# Altium schematic sheet Sheet_4.schdoc
size 232 x 101 mm
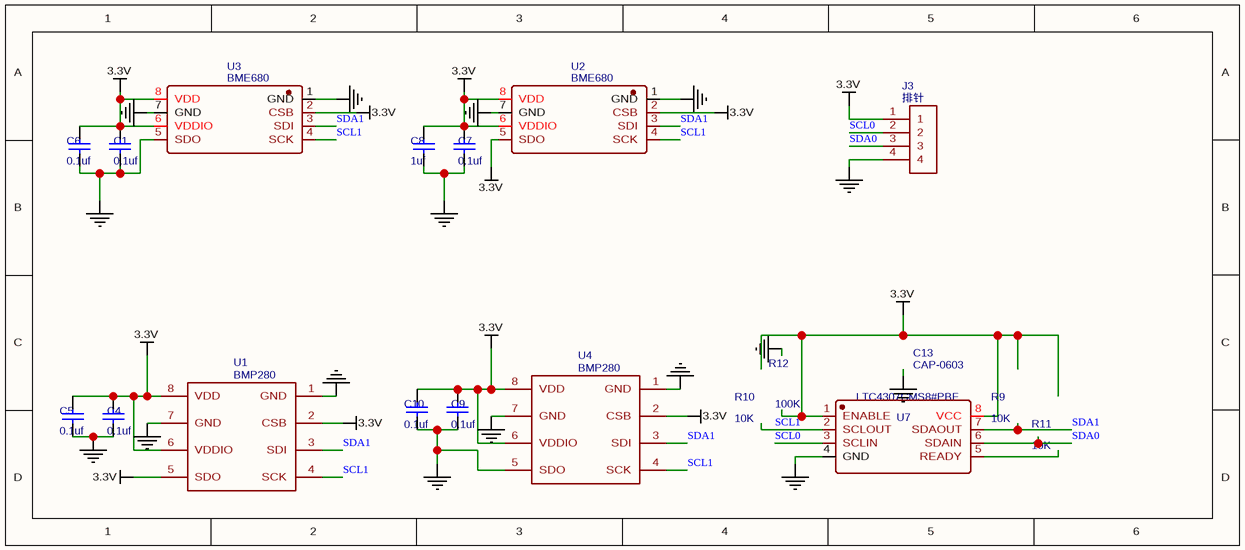
[diagram p0: Sheet_4.schdoc]

## Parts
C1  0.1uf  [N0603]
C4  0.1uf  [N0603]
C5  0.1uf  [N0603]
C6  0.1uf  [N0603]
C7  0.1uf  [N0603]
C8  1uf  [N0603]
C9  0.1uf  [N0603]
C10  0.1uf  [N0603]
C13  CAP-0603  [0603]
J3  排针  [PIN_4*2.54]
R9  10K  [0603]
R10  10K  [0603]
R11  10K  [0603]
R12  100K  [0603]
U1  BMP280  [LGA-8]
U2  BME680  [LGA-8-3X3MM]
U3  BME680  [LGA-8-3X3MM]
U4  BMP280  [LGA-8]
U7  LTC4307CMS8#PBF  [MSOP-8]

## Nets
3.3V: C1.1 C4.1 C5.1 C6.1 C7.1 C8.1 C9.1 C10.1 J3.1 U1.2(CSB) U1.5(SDO) U1.6(VDDIO) U1.8(VDD) U2.2(CSB) U2.5(SDO) U2.6(VDDIO) U2.8(VDD) U3.2(CSB) U3.6(VDDIO) U3.8(VDD) U4.2(CSB) U4.6(VDDIO) U4.8(VDD) U7.1(ENABLE) U7.8(VCC)
GND: C1.2 C4.2 C5.2 C6.2 C7.2 C8.2 C9.2 C10.2 J3.4 U1.1(GND) U1.7(GND) U2.1(GND) U2.7(GND) U3.1(GND) U3.5(SDO) U3.7(GND) U4.1(GND) U4.5(SDO) U4.7(GND) U7.4(GND)
SCL0: J3.2 U7.3(SCLIN)
SCL1: U1.4(SCK) U2.4(SCK) U3.4(SCK) U4.4(SCK) U7.2(SCLOUT)
SDA0: J3.3 U7.6(SDAIN)
SDA1: U1.3(SDI) U2.3(SDI) U3.3(SDI) U4.3(SDI) U7.7(SDAOUT)

Not connected (* = marked no-connect by the designer): U7 5(READY)

## Library data of the parts
C13 = CAP-0603: BOM_描述: 0.1uF; BOM_Price: 0.1; BOM_Manufacturer Part: ?; spicePre: C; BOM_Supplier: LCSC; BOM_Supplier Part: undefined
J3 = 排针: Contributor: cansong; BOM_描述: 4*2.54mm; BOM_Manufacturer Part: 排针; spicePre: J
R9-R11 = 10K: BOM_Manufacturer: LIZ; BOM_Manufacturer Part: CR0603FA1002G; nameAlias: Value; BOM_Supplier: LCSC; spicePre: R; spiceSymbolName: CR0603FA1002G; BOM_描述: 10K; BOM_Supplier Part: C126901
R12 = 100K: BOM_Manufacturer: LIZ; BOM_Manufacturer Part: CR0603FA1002G; nameAlias: Value; BOM_描述: 10K; BOM_Supplier: LCSC; spicePre: R; spiceSymbolName: CR0603FA1002G; BOM_Supplier Part: C126901
U1 U4 = BMP280: BOM_Manufacturer: Bosch; BOM_Supplier: LCSC; BOM_Manufacturer Part: BMP280; BOM_Supplier Part: C83291; spicePre: U
U2 U3 = BME680: BOM_Manufacturer: Bosch Sensortec; Contributor: LCSC; BOM_Supplier: LCSC; BOM_Supplier Part: C125972; BOM_Manufacturer Part: BME680; spicePre: U
U7 = LTC4307CMS8#PBF: BOM_Manufacturer: LINEAR; BOM_Supplier: LCSC; BOM_Manufacturer Part: LTC4307CMS8#PBF; BOM_Supplier Part: C107956; spicePre: U
C1 C4-C7 C9 C10 = 0.1uf: BOM_Manufacturer Part: ?; spicePre: C
C8 = 1uf: BOM_Manufacturer Part: ?; spicePre: C